# EAGLE design Extended_Proto_Cape_A1 (EAGLE 6.5.0)
AUTHOR: HIEU DUONG; CCO: WWW.CIRCUITCO.COM; DN: 999-0004262; REV: A1; TITLE: EXTENDED PROTO CAPE
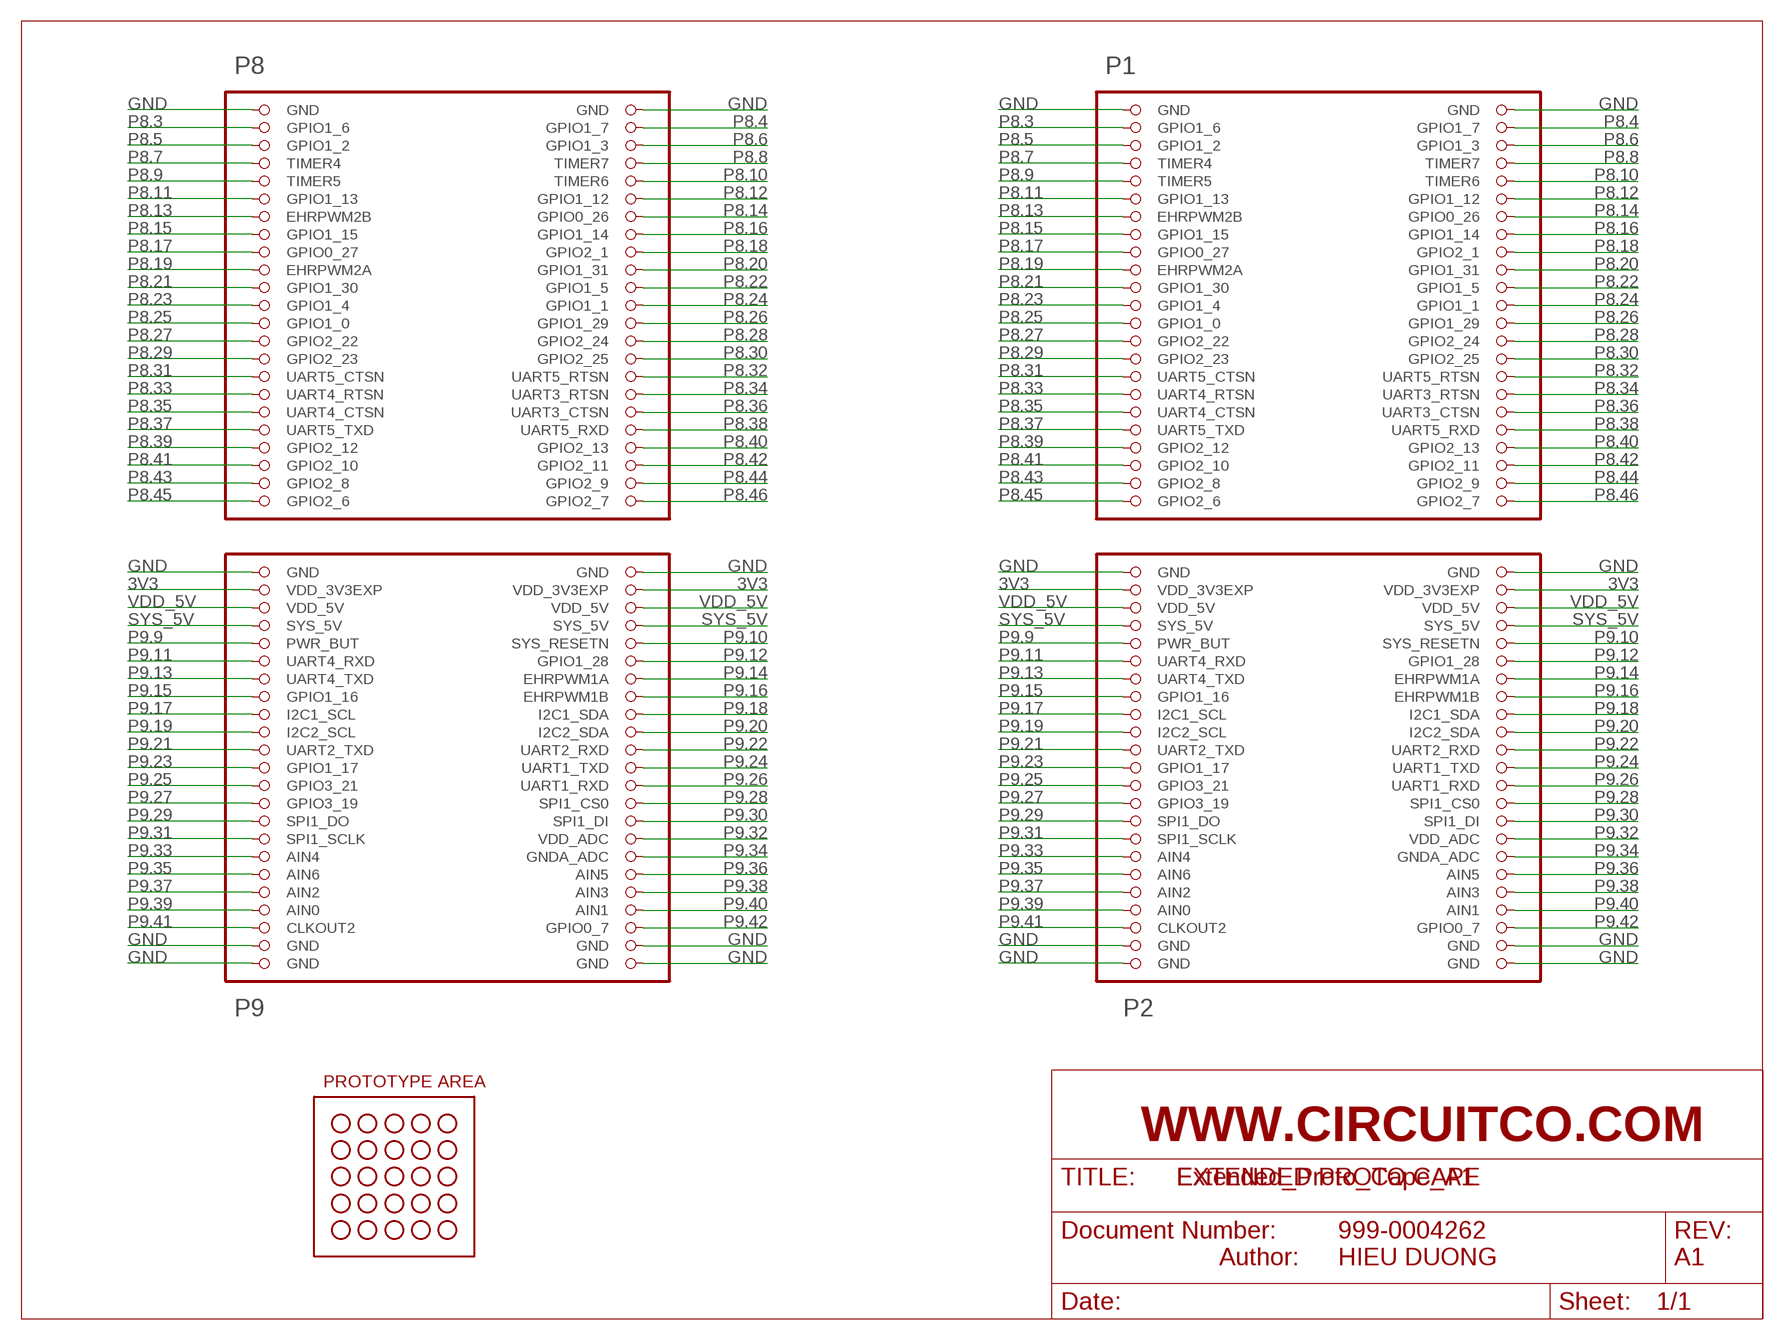
[diagram p0: schematic, sheet 1]

## Parts
U1  BB_OL_EXTPROTO  [BB_OL_EXTPROTO]
U2  PROTO_CAPE_EXT  [PROTO_CAPE_EXT]
U$2  PROTOTYPE_AREA_EXT  [PROTOTYPE_AREA_EXT]

## Nets
3V3: U1.49(VDD_3V3EXP) U1.50(VDD_3V3EXP) U2.49(VDD_3V3EXP) U2.50(VDD_3V3EXP)
GND: U1.1(GND) U1.2(GND) U1.47(GND) U1.48(GND) U1.89(GND) U1.90(GND) U1.91(GND) U1.92(GND) U2.1(GND) U2.2(GND) U2.47(GND) U2.48(GND) U2.89(GND) U2.90(GND) U2.91(GND) U2.92(GND)
P8.3: U1.3(GPIO1_6) U2.3(GPIO1_6)
P8.4: U1.4(GPIO1_7) U2.4(GPIO1_7)
P8.5: U1.5(GPIO1_2) U2.5(GPIO1_2)
P8.6: U1.6(GPIO1_3) U2.6(GPIO1_3)
P8.7: U1.7(TIMER4) U2.7(TIMER4)
P8.8: U1.8(TIMER7) U2.8(TIMER7)
P8.9: U1.9(TIMER5) U2.9(TIMER5)
P8.10: U1.10(TIMER6) U2.10(TIMER6)
P8.11: U1.11(GPIO1_13) U2.11(GPIO1_13)
P8.12: U1.12(GPIO1_12) U2.12(GPIO1_12)
P8.13: U1.13(EHRPWM2B) U2.13(EHRPWM2B)
P8.14: U1.14(GPIO0_26) U2.14(GPIO0_26)
P8.15: U1.15(GPIO1_15) U2.15(GPIO1_15)
P8.16: U1.16(GPIO1_14) U2.16(GPIO1_14)
P8.17: U1.17(GPIO0_27) U2.17(GPIO0_27)
P8.18: U1.18(GPIO2_1) U2.18(GPIO2_1)
P8.19: U1.19(EHRPWM2A) U2.19(EHRPWM2A)
P8.20: U1.20(GPIO1_31) U2.20(GPIO1_31)
P8.21: U1.21(GPIO1_30) U2.21(GPIO1_30)
P8.22: U1.22(GPIO1_5) U2.22(GPIO1_5)
P8.23: U1.23(GPIO1_4) U2.23(GPIO1_4)
P8.24: U1.24(GPIO1_1) U2.24(GPIO1_1)
P8.25: U1.25(GPIO1_0) U2.25(GPIO1_0)
P8.26: U1.26(GPIO1_29) U2.26(GPIO1_29)
P8.27: U1.27(GPIO2_22) U2.27(GPIO2_22)
P8.28: U1.28(GPIO2_24) U2.28(GPIO2_24)
P8.29: U1.29(GPIO2_23) U2.29(GPIO2_23)
P8.30: U1.30(GPIO2_25) U2.30(GPIO2_25)
P8.31: U1.31(UART5_CTSN) U2.31(UART5_CTSN)
P8.32: U1.32(UART5_RTSN) U2.32(UART5_RTSN)
P8.33: U1.33(UART4_RTSN) U2.33(UART4_RTSN)
P8.34: U1.34(UART3_RTSN) U2.34(UART3_RTSN)
P8.35: U1.35(UART4_CTSN) U2.35(UART4_CTSN)
P8.36: U1.36(UART3_CTSN) U2.36(UART3_CTSN)
P8.37: U1.37(UART5_TXD) U2.37(UART5_TXD)
P8.38: U1.38(UART5_RXD) U2.38(UART5_RXD)
P8.39: U1.39(GPIO2_12) U2.39(GPIO2_12)
P8.40: U1.40(GPIO2_13) U2.40(GPIO2_13)
P8.41: U1.41(GPIO2_10) U2.41(GPIO2_10)
P8.42: U1.42(GPIO2_11) U2.42(GPIO2_11)
P8.43: U1.43(GPIO2_8) U2.43(GPIO2_8)
P8.44: U1.44(GPIO2_9) U2.44(GPIO2_9)
P8.45: U1.45(GPIO2_6) U2.45(GPIO2_6)
P8.46: U1.46(GPIO2_7) U2.46(GPIO2_7)
P9.9: U1.55(PWR_BUT) U2.55(PWR_BUT)
P9.10: U1.56(SYS_RESETN) U2.56(SYS_RESETN)
P9.11: U1.57(UART4_RXD) U2.57(UART4_RXD)
P9.12: U1.58(GPIO1_28) U2.58(GPIO1_28)
P9.13: U1.59(UART4_TXD) U2.59(UART4_TXD)
P9.14: U1.60(EHRPWM1A) U2.60(EHRPWM1A)
P9.15: U1.61(GPIO1_16) U2.61(GPIO1_16)
P9.16: U1.62(EHRPWM1B) U2.62(EHRPWM1B)
P9.17: U1.63(I2C1_SCL) U2.63(I2C1_SCL)
P9.18: U1.64(I2C1_SDA) U2.64(I2C1_SDA)
P9.19: U1.65(I2C2_SCL) U2.65(I2C2_SCL)
P9.20: U1.66(I2C2_SDA) U2.66(I2C2_SDA)
P9.21: U1.67(UART2_TXD) U2.67(UART2_TXD)
P9.22: U1.68(UART2_RXD) U2.68(UART2_RXD)
P9.23: U1.69(GPIO1_17) U2.69(GPIO1_17)
P9.24: U1.70(UART1_TXD) U2.70(UART1_TXD)
P9.25: U1.71(GPIO3_21) U2.71(GPIO3_21)
P9.26: U1.72(UART1_RXD) U2.72(UART1_RXD)
P9.27: U1.73(GPIO3_19) U2.73(GPIO3_19)
P9.28: U1.74(SPI1_CS0) U2.74(SPI1_CS0)
P9.29: U1.75(SPI1_DO) U2.75(SPI1_DO)
P9.30: U1.76(SPI1_DI) U2.76(SPI1_DI)
P9.31: U1.77(SPI1_SCLK) U2.77(SPI1_SCLK)
P9.32: U1.78(VDD_ADC) U2.78(VDD_ADC)
P9.33: U1.79(AIN4) U2.79(AIN4)
P9.34: U1.80(GNDA_ADC) U2.80(GNDA_ADC)
P9.35: U1.81(AIN6) U2.81(AIN6)
P9.36: U1.82(AIN5) U2.82(AIN5)
P9.37: U1.83(AIN2) U2.83(AIN2)
P9.38: U1.84(AIN3) U2.84(AIN3)
P9.39: U1.85(AIN0) U2.85(AIN0)
P9.40: U1.86(AIN1) U2.86(AIN1)
P9.41: U1.87(CLKOUT2) U2.87(CLKOUT2)
P9.42: U1.88(GPIO0_7) U2.88(GPIO0_7)
SYS_5V: U1.53(SYS_5V) U1.54(SYS_5V) U2.53(SYS_5V) U2.54(SYS_5V)
VDD_5V: U1.51(VDD_5V) U1.52(VDD_5V) U2.51(VDD_5V) U2.52(VDD_5V)

## Notes on the sheet
- P8 | P1
- P9 | P2
- PROTOTYPE AREA
- Author:

## Library data of the parts
U1 = circuitco-eagle:BB_OL_EXTPROTO: Should match A3 pinout - but not completely tested
U2 = circuitco-eagle:PROTO_CAPE_EXT
U$2 = circuitco-eagle:PROTOTYPE_AREA_EXT

## Board
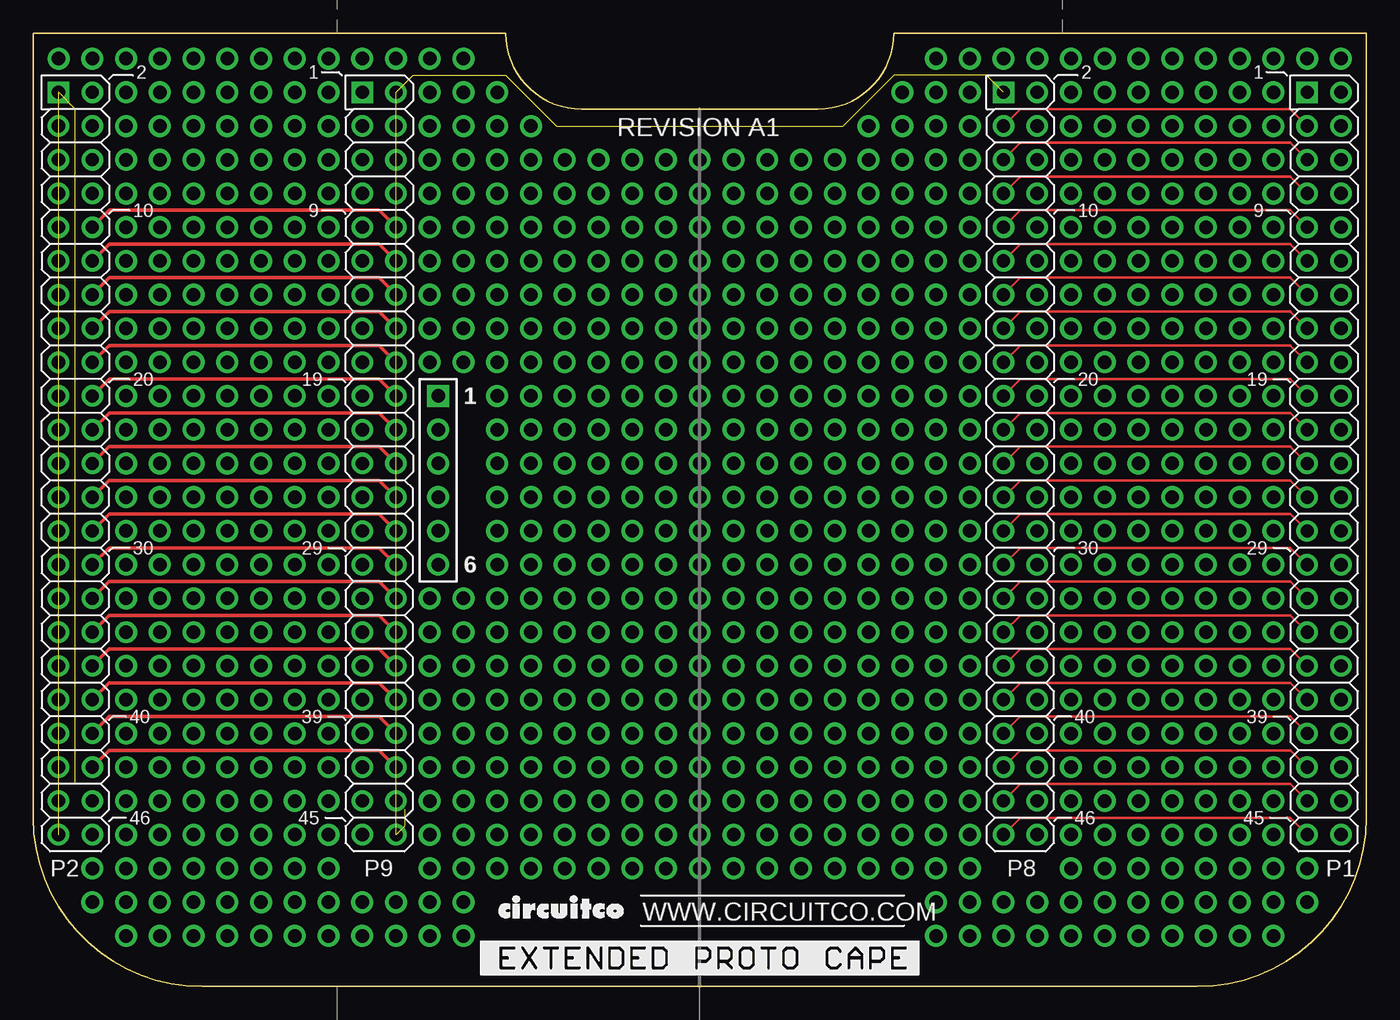
[diagram p1: board, top side]
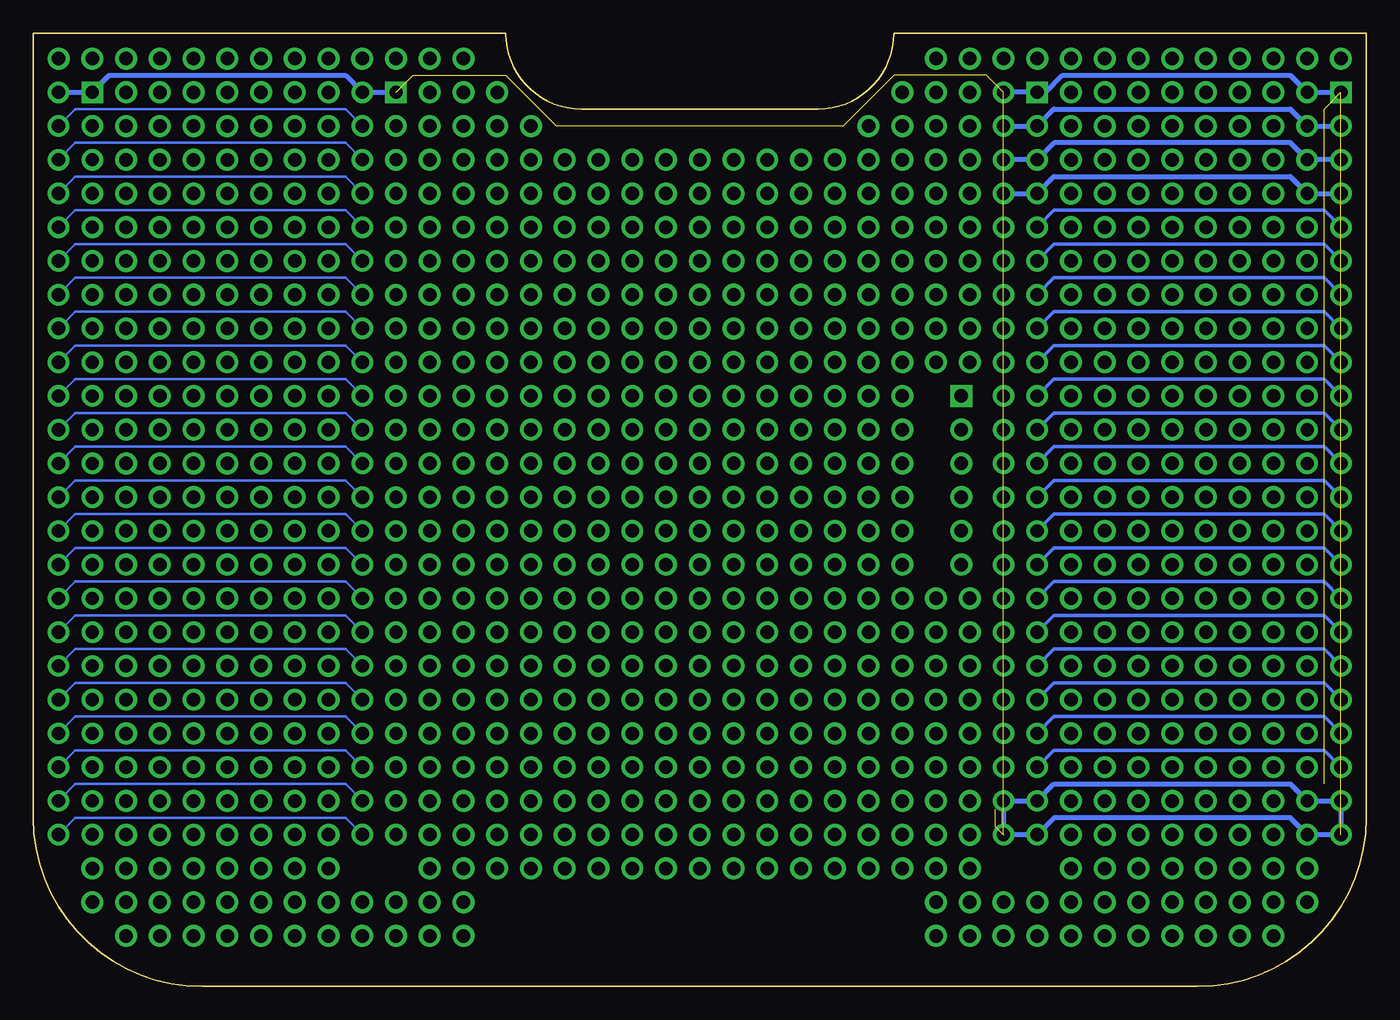
[diagram p2: board, bottom side, seen from below]

Size 100.33 x 71.75 mm. Coordinates in mm from the lower left corner, seen from the top.
Copper layers (1*16): Top 0.035mm / dielectric 1.5mm / Bottom 0.035mm
Design rules "CircuitCo-HD": minimum track width 8mil, minimum drill 15mil, track to track 8mil, track to pad 8mil, pad to pad 3mil, via to via 8mil, smd to smd 0mil, copper to edge 12mil, drill to drill 8mil, minimum pad ring 12mil, minimum via ring 10mil, stop-mask expansion 4mil, vias tented up to drill 25mil, thermal gap 10mil

### Footprints (pad centres in the part's own frame; a part is rotated, then mirrored left to right if it is on the bottom)
BB_OL_EXTPROTO = drill 1 square: 1 50.165,67.31; 47 1.905,67.31 | drill 1: 2 52.705,67.31; 3 50.165,64.77; 4 52.705,64.77; 5 50.165,62.23; 6 52.705,62.23; 7 50.165,59.69; 8 52.705,59.69; 9 50.165,57.15; 10 52.705,57.15; 11 50.165,54.61; 12 52.705,54.61; 13 50.165,52.07; 14 52.705,52.07; 15 50.165,49.53; 16 52.705,49.53; 17 50.165,46.99; 18 52.705,46.99; 19 50.165,44.45; 20 52.705,44.45; 21 50.165,41.91; 22 52.705,41.91; 23 50.165,39.37; 24 52.705,39.37; 25 50.165,36.83; 26 52.705,36.83; 27 50.165,34.29; 28 52.705,34.29; 29 50.165,31.75; 30 52.705,31.75; 31 50.165,29.21; 32 52.705,29.21; 33 50.165,26.67; 34 52.705,26.67; 35 50.165,24.13; 36 52.705,24.13; 37 50.165,21.59; 38 52.705,21.59; 39 50.165,19.05; 40 52.705,19.05; 41 50.165,16.51; 42 52.705,16.51; 43 50.165,13.97; 44 52.705,13.97; 45 50.165,11.43; 46 52.705,11.43; 48 4.445,67.31; 49 1.905,64.77; 50 4.445,64.77; 51 1.905,62.23; 52 4.445,62.23; 53 1.905,59.69; 54 4.445,59.69; 55 1.905,57.15; 56 4.445,57.15; 57 1.905,54.61; 58 4.445,54.61; 59 1.905,52.07; 60 4.445,52.07; 61 1.905,49.53; 62 4.445,49.53; 63 1.905,46.99; 64 4.445,46.99; 65 1.905,44.45; 66 4.445,44.45; 67 1.905,41.91; 68 4.445,41.91; 69 1.905,39.37; 70 4.445,39.37; 71 1.905,36.83; 72 4.445,36.83; 73 1.905,34.29; 74 4.445,34.29; 75 1.905,31.75; 76 4.445,31.75; 77 1.905,29.21; 78 4.445,29.21; 79 1.905,26.67; 80 4.445,26.67; 81 1.905,24.13; 82 4.445,24.13; 83 1.905,21.59; 84 4.445,21.59; 85 1.905,19.05; 86 4.445,19.05; 87 1.905,16.51; 88 4.445,16.51; 89 1.905,13.97; 90 4.445,13.97; 91 1.905,11.43; 92 4.445,11.43
PROTO_CAPE_EXT = drill 1 square: 1 73.025,67.31; 47 -20.955,67.31 | drill 1: 2 75.565,67.31; 3 73.025,64.77; 4 75.565,64.77; 5 73.025,62.23; 6 75.565,62.23; 7 73.025,59.69; 8 75.565,59.69; 9 73.025,57.15; 10 75.565,57.15; 11 73.025,54.61; 12 75.565,54.61; 13 73.025,52.07; 14 75.565,52.07; 15 73.025,49.53; 16 75.565,49.53; 17 73.025,46.99; 18 75.565,46.99; 19 73.025,44.45; 20 75.565,44.45; 21 73.025,41.91; 22 75.565,41.91; 23 73.025,39.37; 24 75.565,39.37; 25 73.025,36.83; 26 75.565,36.83; 27 73.025,34.29; 28 75.565,34.29; 29 73.025,31.75; 30 75.565,31.75; 31 73.025,29.21; 32 75.565,29.21; 33 73.025,26.67; 34 75.565,26.67; 35 73.025,24.13; 36 75.565,24.13; 37 73.025,21.59; 38 75.565,21.59; 39 73.025,19.05; 40 75.565,19.05; 41 73.025,16.51; 42 75.565,16.51; 43 73.025,13.97; 44 75.565,13.97; 45 73.025,11.43; 46 75.565,11.43; 48 -18.415,67.31; 49 -20.955,64.77; 50 -18.415,64.77; 51 -20.955,62.23; 52 -18.415,62.23; 53 -20.955,59.69; 54 -18.415,59.69; 55 -20.955,57.15; 56 -18.415,57.15; 57 -20.955,54.61; 58 -18.415,54.61; 59 -20.955,52.07; 60 -18.415,52.07; 61 -20.955,49.53; 62 -18.415,49.53; 63 -20.955,46.99; 64 -18.415,46.99; 65 -20.955,44.45; 66 -18.415,44.45; 67 -20.955,41.91; 68 -18.415,41.91; 69 -20.955,39.37; 70 -18.415,39.37; 71 -20.955,36.83; 72 -18.415,36.83; 73 -20.955,34.29; 74 -18.415,34.29; 75 -20.955,31.75; 76 -18.415,31.75; 77 -20.955,29.21; 78 -18.415,29.21; 79 -20.955,26.67; 80 -18.415,26.67; 81 -20.955,24.13; 82 -18.415,24.13; 83 -20.955,21.59; 84 -18.415,21.59; 85 -20.955,19.05; 86 -18.415,19.05; 87 -20.955,16.51; 88 -18.415,16.51; 89 -20.955,13.97; 90 -18.415,13.97; 91 -20.955,11.43; 92 -18.415,11.43
PROTOTYPE_AREA_EXT = drill 1.016 pad 1.651 square: P$1 30.48,44.45 | drill 1.016 pad 1.651: P$2 30.48,41.91; P$3 30.48,39.37; P$4 30.48,36.83; P$5 30.48,34.29; P$6 30.48,31.75; P$7 29.845,67.31; P$8 29.845,64.77; P$9 29.845,62.23; P$10 29.845,59.69; P$11 29.845,57.15; P$12 29.845,54.61; P$13 29.845,52.07; P$14 29.845,49.53; P$15 29.845,46.99; P$16 32.385,67.31; P$17 32.385,64.77; P$18 32.385,62.23; P$19 32.385,59.69; P$20 32.385,57.15; P$21 32.385,54.61; P$22 32.385,52.07; P$23 32.385,49.53; P$24 32.385,46.99; P$25 34.925,67.31; P$26 34.925,64.77; P$27 34.925,62.23; P$28 34.925,59.69; P$29 34.925,57.15; P$30 34.925,54.61; P$31 34.925,52.07; P$32 34.925,49.53; P$33 34.925,46.99; P$34 29.845,69.85; P$35 32.385,69.85; P$36 27.305,69.85; P$37 24.765,69.85; P$38 34.925,44.45; P$39 34.925,41.91; P$40 34.925,39.37; P$41 34.925,36.83; P$42 34.925,34.29; P$43 34.925,31.75; P$44 34.925,29.21; P$45 34.925,26.67; P$46 34.925,24.13; P$47 34.925,21.59; P$48 34.925,19.05; P$49 34.925,16.51; P$50 34.925,13.97; P$51 34.925,11.43; P$52 34.925,8.89; P$53 24.765,6.35; P$54 24.765,3.81; P$55 32.385,29.21; P$56 32.385,26.67; P$57 32.385,24.13; P$58 32.385,21.59; P$59 32.385,19.05; P$60 32.385,16.51; P$61 32.385,13.97; P$62 32.385,11.43; P$63 32.385,8.89; P$64 27.305,6.35; P$65 27.305,3.81; P$66 29.845,29.21; P$67 29.845,26.67; P$68 29.845,24.13; P$69 29.845,21.59; P$70 29.845,19.05; P$71 29.845,16.51; P$72 29.845,13.97; P$73 29.845,11.43; P$74 29.845,8.89; P$75 29.845,6.35; P$76 29.845,3.81; P$77 32.385,6.35; P$78 70.485,6.35; P$79 70.485,3.81; P$80 32.385,3.81; P$81 73.025,6.35; P$82 73.025,3.81; P$83 37.465,64.77; P$84 37.465,62.23; P$85 37.465,59.69; P$86 37.465,57.15; P$87 37.465,54.61; P$88 37.465,52.07; P$89 37.465,49.53; P$90 37.465,46.99; P$91 37.465,44.45; P$92 37.465,41.91; P$93 37.465,39.37; P$94 37.465,36.83; P$95 37.465,34.29; P$96 37.465,31.75; P$97 37.465,29.21; P$98 37.465,26.67; P$99 37.465,24.13; P$100 37.465,21.59; P$101 37.465,19.05; P$102 37.465,16.51; P$103 37.465,13.97; P$104 37.465,11.43; P$105 37.465,8.89; P$106 75.565,6.35; P$107 75.565,3.81; P$108 40.005,62.23; P$109 40.005,59.69; P$110 40.005,57.15; P$111 40.005,54.61; P$112 40.005,52.07; P$113 40.005,49.53; P$114 40.005,46.99; P$115 40.005,44.45; P$116 40.005,41.91; P$117 40.005,39.37; P$118 40.005,36.83; P$119 40.005,34.29; P$120 40.005,31.75; P$121 40.005,29.21; P$122 40.005,26.67; P$123 40.005,24.13; P$124 40.005,21.59; P$125 40.005,19.05; P$126 40.005,16.51; P$127 40.005,13.97; P$128 40.005,11.43; P$129 40.005,8.89; P$130 67.945,6.35; P$131 67.945,3.81; P$132 42.545,62.23; P$133 42.545,59.69; P$134 42.545,57.15; P$135 42.545,54.61; P$136 42.545,52.07; P$137 42.545,49.53; P$138 42.545,46.99; P$139 42.545,44.45; P$140 42.545,41.91; P$141 42.545,39.37; P$142 42.545,36.83; P$143 42.545,34.29; P$144 42.545,31.75; P$145 42.545,29.21; P$146 42.545,26.67; P$147 42.545,24.13; P$148 42.545,21.59; P$149 42.545,19.05; P$150 42.545,16.51; P$151 42.545,13.97; P$152 42.545,11.43; P$153 42.545,8.89; P$156 45.085,62.23; P$157 45.085,59.69; P$158 45.085,57.15; P$159 45.085,54.61; P$160 45.085,52.07; P$161 45.085,49.53; P$162 45.085,46.99; P$163 45.085,44.45; P$164 45.085,41.91; P$165 45.085,39.37; P$166 45.085,36.83; P$167 45.085,34.29; P$168 45.085,31.75; P$169 47.625,49.53; P$170 47.625,46.99; P$171 45.085,24.13; P$172 45.085,21.59; P$173 45.085,19.05; P$174 45.085,16.51; P$175 45.085,13.97; P$176 45.085,11.43; P$177 45.085,8.89; P$180 47.625,62.23; P$181 47.625,59.69; P$182 47.625,57.15; P$183 47.625,54.61; P$184 47.625,52.07; P$185 47.625,44.45; P$186 47.625,41.91; P$187 47.625,39.37; P$188 47.625,36.83; P$189 47.625,34.29; P$190 47.625,31.75; P$191 50.165,49.53; P$192 50.165,46.99; P$193 50.165,44.45; P$194 50.165,41.91; P$195 47.625,24.13; P$196 47.625,21.59; P$197 47.625,19.05; P$198 47.625,16.51; P$199 47.625,13.97; P$200 47.625,11.43; P$201 47.625,8.89; P$204 50.165,62.23; P$205 50.165,59.69; P$206 50.165,57.15; P$207 50.165,54.61; P$208 50.165,52.07; P$209 50.165,39.37; P$210 50.165,36.83; P$211 50.165,34.29; P$212 50.165,31.75; P$213 52.705,49.53; P$214 52.705,46.99; P$215 52.705,44.45; P$216 52.705,41.91; P$217 52.705,39.37; P$218 52.705,36.83; P$219 50.165,24.13; P$220 50.165,21.59; P$221 50.165,19.05; P$222 50.165,16.51; P$223 50.165,13.97; P$224 50.165,11.43; P$225 50.165,8.89; P$228 52.705,62.23; P$229 52.705,59.69; P$230 52.705,57.15; P$231 52.705,54.61; P$232 52.705,52.07; P$233 52.705,34.29; P$234 52.705,31.75; P$235 55.245,49.53; P$236 55.245,46.99; P$237 55.245,44.45; P$238 55.245,41.91; P$239 55.245,39.37; P$240 55.245,36.83; P$241 55.245,34.29; P$242 55.245,31.75; P$243 52.705,24.13; P$244 52.705,21.59; P$245 52.705,19.05; P$246 52.705,16.51; P$247 52.705,13.97; P$248 52.705,11.43; P$249 52.705,8.89; P$252 55.245,62.23; P$253 55.245,59.69; P$254 55.245,57.15; P$255 55.245,54.61; P$256 55.245,52.07; P$257 55.245,29.21; P$258 55.245,26.67; P$259 45.085,29.21; P$260 45.085,26.67; P$261 47.625,29.21; P$262 47.625,26.67; P$263 50.165,29.21; P$264 50.165,26.67; P$265 52.705,29.21; P$266 52.705,26.67; P$267 55.245,24.13; P$268 55.245,21.59; P$269 55.245,19.05; P$270 55.245,16.51; P$271 55.245,13.97; P$272 55.245,11.43; P$273 55.245,8.89; P$276 57.785,62.23; P$277 57.785,59.69; P$278 57.785,57.15; P$279 57.785,54.61; P$280 57.785,52.07; P$281 57.785,49.53; P$282 57.785,46.99; P$283 57.785,44.45; P$284 57.785,41.91; P$285 57.785,39.37; P$286 57.785,36.83; P$287 57.785,34.29; P$288 57.785,31.75; P$289 57.785,29.21; P$290 57.785,26.67; P$291 57.785,24.13; P$292 57.785,21.59; P$293 57.785,19.05; P$294 57.785,16.51; P$295 57.785,13.97; P$296 57.785,11.43; P$297 57.785,8.89; P$300 60.325,62.23; P$301 60.325,59.69; P$302 60.325,57.15; P$303 60.325,54.61; P$304 60.325,52.07; P$305 60.325,49.53; P$306 60.325,46.99; P$307 60.325,44.45; P$308 60.325,41.91; P$309 60.325,39.37; P$310 60.325,36.83; P$311 60.325,34.29; P$312 60.325,31.75; P$313 60.325,29.21; P$314 60.325,26.67; P$315 60.325,24.13; P$316 60.325,21.59; P$317 60.325,19.05; P$318 60.325,16.51; P$319 60.325,13.97; P$320 60.325,11.43; P$321 60.325,8.89; P$324 62.865,62.23; P$325 62.865,59.69; P$326 62.865,57.15; P$327 62.865,54.61; P$328 62.865,52.07; P$329 62.865,49.53; P$330 62.865,46.99; P$331 62.865,44.45; P$332 62.865,41.91; P$333 62.865,39.37; P$334 62.865,36.83; P$335 62.865,34.29; P$336 62.865,31.75; P$337 62.865,29.21; P$338 62.865,26.67; P$339 62.865,24.13; P$340 62.865,21.59; P$341 62.865,19.05; P$342 62.865,16.51; P$343 62.865,13.97; P$344 62.865,11.43; P$345 62.865,8.89; P$348 65.405,62.23; P$349 65.405,59.69; P$350 65.405,57.15; P$351 65.405,54.61; P$352 65.405,52.07; P$353 65.405,49.53; P$354 65.405,46.99; P$355 65.405,44.45; P$356 65.405,41.91; P$357 65.405,39.37; P$358 65.405,36.83; P$359 65.405,34.29; P$360 65.405,31.75; P$361 65.405,29.21; P$362 65.405,26.67; P$363 65.405,24.13; P$364 65.405,21.59; P$365 65.405,19.05; P$366 65.405,16.51; P$367 65.405,13.97; P$368 65.405,11.43; P$369 65.405,8.89; P$372 67.945,62.23; P$373 67.945,59.69; P$374 67.945,57.15; P$375 67.945,54.61; P$376 67.945,52.07; P$377 67.945,49.53; P$378 67.945,46.99; P$379 67.945,44.45; P$380 67.945,41.91; P$381 67.945,39.37; P$382 67.945,36.83; P$383 67.945,34.29; P$384 67.945,31.75; P$385 67.945,29.21; P$386 67.945,26.67; P$387 67.945,24.13; P$388 67.945,21.59; P$389 67.945,19.05; P$390 67.945,16.51; P$391 67.945,13.97; P$392 67.945,11.43; P$393 67.945,8.89; P$396 70.485,62.23; P$397 70.485,59.69; P$398 70.485,57.15; P$399 70.485,54.61; P$400 70.485,52.07; P$401 70.485,49.53; P$402 70.485,46.99; P$403 70.485,44.45; P$404 70.485,41.91; P$405 70.485,39.37; P$406 70.485,36.83; P$407 70.485,34.29; P$408 70.485,31.75; P$409 70.485,29.21; P$410 70.485,26.67; P$411 70.485,24.13; P$412 70.485,21.59; P$413 70.485,19.05; P$414 70.485,16.51; P$415 70.485,13.97; P$416 70.485,11.43; P$417 70.485,8.89; P$420 62.865,64.77; P$421 65.405,64.77; P$422 67.945,64.77; P$423 70.485,64.77; P$424 65.405,67.31; P$425 67.945,67.31; P$426 70.485,67.31; P$427 67.945,69.85; P$428 70.485,69.85; P$429 78.105,62.23; P$430 78.105,59.69; P$431 78.105,57.15; P$432 78.105,54.61; P$433 78.105,52.07; P$434 78.105,49.53; P$435 78.105,46.99; P$436 78.105,44.45; P$437 78.105,41.91; P$438 78.105,39.37; P$439 78.105,36.83; P$440 78.105,34.29; P$441 78.105,31.75; P$442 78.105,29.21; P$443 78.105,26.67; P$444 78.105,24.13; P$445 78.105,21.59; P$446 78.105,19.05; P$447 78.105,16.51; P$448 78.105,13.97; P$449 78.105,11.43; P$450 78.105,8.89; P$451 78.105,6.35; P$452 78.105,3.81; P$453 80.645,62.23; P$454 80.645,59.69; P$455 80.645,57.15; P$456 80.645,54.61; P$457 80.645,52.07; P$458 80.645,49.53; P$459 80.645,46.99; P$460 80.645,44.45; P$461 80.645,41.91; P$462 80.645,39.37; P$463 80.645,36.83; P$464 80.645,34.29; P$465 80.645,31.75; P$466 80.645,29.21; P$467 80.645,26.67; P$468 80.645,24.13; P$469 80.645,21.59; P$470 80.645,19.05; P$471 80.645,16.51; P$472 80.645,13.97; P$473 80.645,11.43; P$474 80.645,8.89; P$475 80.645,6.35; P$476 80.645,3.81; P$477 78.105,64.77; P$478 80.645,64.77; P$479 78.105,67.31; P$480 80.645,67.31; P$487 73.025,69.85; P$488 75.565,69.85; P$489 78.105,69.85; P$490 80.645,69.85; P$491 83.185,62.23; P$492 83.185,59.69; P$493 83.185,57.15; P$494 83.185,54.61; P$495 83.185,52.07; P$496 83.185,49.53; P$497 83.185,46.99; P$498 83.185,44.45; P$499 83.185,41.91; P$500 83.185,39.37; P$501 83.185,36.83; P$502 83.185,34.29; P$503 83.185,31.75; P$504 83.185,29.21; P$505 83.185,26.67; P$506 83.185,24.13; P$507 83.185,21.59; P$508 83.185,19.05; P$509 83.185,16.51; P$510 83.185,13.97; P$511 83.185,11.43; P$512 83.185,8.89; P$513 83.185,6.35; P$514 83.185,3.81; P$515 85.725,62.23; P$516 85.725,59.69; P$517 85.725,57.15; P$518 85.725,54.61; P$519 85.725,52.07; P$520 85.725,49.53; P$521 85.725,46.99; P$522 85.725,44.45; P$523 85.725,41.91; P$524 85.725,39.37; P$525 85.725,36.83; P$526 85.725,34.29; P$527 85.725,31.75; P$528 85.725,29.21; P$529 85.725,26.67; P$530 85.725,24.13; P$531 85.725,21.59; P$532 85.725,19.05; P$533 85.725,16.51; P$534 85.725,13.97; P$535 85.725,11.43; P$536 85.725,8.89; P$537 85.725,6.35; P$538 85.725,3.81; P$539 83.185,64.77; P$540 85.725,64.77; P$541 83.185,67.31; P$542 85.725,67.31; P$543 83.185,69.85; P$544 85.725,69.85; P$545 88.265,62.23; P$546 88.265,59.69; P$547 88.265,57.15; P$548 88.265,54.61; P$549 88.265,52.07; P$550 88.265,49.53; P$551 88.265,46.99; P$552 88.265,44.45; P$553 88.265,41.91; P$554 88.265,39.37; P$555 88.265,36.83; P$556 88.265,34.29; P$557 88.265,31.75; P$558 88.265,29.21; P$559 88.265,26.67; P$560 88.265,24.13; P$561 88.265,21.59; P$562 88.265,19.05; P$563 88.265,16.51; P$564 88.265,13.97; P$565 88.265,11.43; P$566 88.265,8.89; P$567 88.265,6.35; P$568 88.265,3.81; P$569 88.265,64.77; P$570 88.265,67.31; P$571 88.265,69.85; P$572 90.805,62.23; P$573 90.805,59.69; P$574 90.805,57.15; P$575 90.805,54.61; P$576 90.805,52.07; P$577 90.805,49.53; P$578 90.805,46.99; P$579 90.805,44.45; P$580 90.805,41.91; P$581 90.805,39.37; P$582 90.805,36.83; P$583 90.805,34.29; P$584 90.805,31.75; P$585 90.805,29.21; P$586 90.805,26.67; P$587 90.805,24.13; P$588 90.805,21.59; P$589 90.805,19.05; P$590 90.805,16.51; P$591 90.805,13.97; P$592 90.805,11.43; P$593 90.805,8.89; P$594 90.805,6.35; P$595 90.805,3.81; P$596 90.805,64.77; P$597 90.805,67.31; P$598 90.805,69.85; P$599 93.345,62.23; P$600 93.345,59.69; P$601 93.345,57.15; P$602 93.345,54.61; P$603 93.345,52.07; P$604 93.345,49.53; P$605 93.345,46.99; P$606 93.345,44.45; P$607 93.345,41.91; P$608 93.345,39.37; P$609 93.345,36.83; P$610 93.345,34.29; P$611 93.345,31.75; P$612 93.345,29.21; P$613 93.345,26.67; P$614 93.345,24.13; P$615 93.345,21.59; P$616 93.345,19.05; P$617 93.345,16.51; P$618 93.345,13.97; P$619 93.345,11.43; P$620 93.345,8.89; P$621 93.345,6.35; P$622 93.345,3.81; P$623 93.345,64.77; P$624 93.345,67.31; P$625 93.345,69.85; P$626 6.985,62.23; P$627 6.985,59.69; P$628 6.985,57.15; P$629 6.985,54.61; P$630 6.985,52.07; P$631 6.985,49.53; P$632 6.985,46.99; P$633 6.985,44.45; P$634 6.985,41.91; P$635 6.985,39.37; P$636 6.985,36.83; P$637 6.985,34.29; P$638 6.985,31.75; P$639 6.985,29.21; P$640 6.985,26.67; P$641 6.985,24.13; P$642 6.985,21.59; P$643 6.985,19.05; P$644 6.985,16.51; P$645 6.985,13.97; P$646 6.985,11.43; P$647 6.985,8.89; P$648 6.985,6.35; P$649 6.985,3.81; P$650 9.525,62.23; P$651 9.525,59.69; P$652 9.525,57.15; P$653 9.525,54.61; P$654 9.525,52.07; P$655 9.525,49.53; P$656 9.525,46.99; P$657 9.525,44.45; P$658 9.525,41.91; P$659 9.525,39.37; P$660 9.525,36.83; P$661 9.525,34.29; P$662 9.525,31.75; P$663 9.525,29.21; P$664 9.525,26.67; P$665 9.525,24.13; P$666 9.525,21.59; P$667 9.525,19.05; P$668 9.525,16.51; P$669 9.525,13.97; P$670 9.525,11.43; P$671 9.525,8.89; P$672 9.525,6.35; P$673 9.525,3.81; P$674 6.985,64.77; P$675 9.525,64.77; P$676 6.985,67.31; P$677 9.525,67.31; P$678 6.985,69.85; P$679 9.525,69.85; P$680 12.065,62.23; P$681 12.065,59.69; P$682 12.065,57.15; P$683 12.065,54.61; P$684 12.065,52.07; P$685 12.065,49.53; P$686 12.065,46.99; P$687 12.065,44.45; P$688 12.065,41.91; P$689 12.065,39.37; P$690 12.065,36.83; P$691 12.065,34.29; P$692 12.065,31.75; P$693 12.065,29.21; P$694 12.065,26.67; P$695 12.065,24.13; P$696 12.065,21.59; P$697 12.065,19.05; P$698 12.065,16.51; P$699 12.065,13.97; P$700 12.065,11.43; P$701 12.065,8.89; P$702 12.065,6.35; P$703 12.065,3.81; P$704 14.605,62.23; P$705 14.605,59.69; P$706 14.605,57.15; P$707 14.605,54.61; P$708 14.605,52.07; P$709 14.605,49.53; P$710 14.605,46.99; P$711 14.605,44.45; P$712 14.605,41.91; P$713 14.605,39.37; P$714 14.605,36.83; P$715 14.605,34.29; P$716 14.605,31.75; P$717 14.605,29.21; P$718 14.605,26.67; P$719 14.605,24.13; P$720 14.605,21.59; P$721 14.605,19.05; P$722 14.605,16.51; P$723 14.605,13.97; P$724 14.605,11.43; P$725 14.605,8.89; P$726 14.605,6.35; P$727 14.605,3.81; P$728 12.065,64.77; P$729 14.605,64.77; P$730 12.065,67.31; P$731 14.605,67.31; P$732 12.065,69.85; P$733 14.605,69.85; P$734 17.145,62.23; P$735 17.145,59.69; P$736 17.145,57.15; P$737 17.145,54.61; P$738 17.145,52.07; P$739 17.145,49.53; P$740 17.145,46.99; P$741 17.145,44.45; P$742 17.145,41.91; P$743 17.145,39.37; P$744 17.145,36.83; P$745 17.145,34.29; P$746 17.145,31.75; P$747 17.145,29.21; P$748 17.145,26.67; P$749 17.145,24.13; P$750 17.145,21.59; P$751 17.145,19.05; P$752 17.145,16.51; P$753 17.145,13.97; P$754 17.145,11.43; P$755 17.145,8.89; P$756 17.145,6.35; P$757 17.145,3.81; P$758 17.145,64.77; P$759 17.145,67.31; P$760 17.145,69.85; P$761 19.685,62.23; P$762 19.685,59.69; P$763 19.685,57.15; P$764 19.685,54.61; P$765 19.685,52.07; P$766 19.685,49.53; P$767 19.685,46.99; P$768 19.685,44.45; P$769 19.685,41.91; P$770 19.685,39.37; P$771 19.685,36.83; P$772 19.685,34.29; P$773 19.685,31.75; P$774 19.685,29.21; P$775 19.685,26.67; P$776 19.685,24.13; P$777 19.685,21.59; P$778 19.685,19.05; P$779 19.685,16.51; P$780 19.685,13.97; P$781 19.685,11.43; P$782 19.685,8.89; P$783 19.685,6.35; P$784 19.685,3.81; P$785 19.685,64.77; P$786 19.685,67.31; P$787 19.685,69.85; P$788 22.225,62.23; P$789 22.225,59.69; P$790 22.225,57.15; P$791 22.225,54.61; P$792 22.225,52.07; P$793 22.225,49.53; P$794 22.225,46.99; P$795 22.225,44.45; P$796 22.225,41.91; P$797 22.225,39.37; P$798 22.225,36.83; P$799 22.225,34.29; P$800 22.225,31.75; P$801 22.225,29.21; P$802 22.225,26.67; P$803 22.225,24.13; P$804 22.225,21.59; P$805 22.225,19.05; P$806 22.225,16.51; P$807 22.225,13.97; P$808 22.225,11.43; P$809 22.225,8.89; P$810 22.225,6.35; P$811 22.225,3.81; P$812 22.225,64.77; P$813 22.225,67.31; P$814 22.225,69.85; P$836 95.885,8.89; P$837 95.885,6.35; P$840 95.885,69.85; P$865 98.425,69.85; P$886 4.445,8.89; P$887 4.445,6.35; P$890 4.445,69.85; P$914 1.905,69.85

### Placement (x,y rotation side)
DRILEGEND  [DRILEGEND]  -1.02,-21.07 0 top  (outside the outline)
U1  22.86,0 0 top
U2  22.86,0 0 top
U$1  [NEGA-EXTPROTOCAPE]  32.39,-0.64 0 top
U$2  0,0 0 top

### Tracks (layer width: path | path; a pad name or v marks a point on that pad's centre or on a via)
3V3
  Bottom 0.381: U1.50 U1.49 23.49,66.04 5.71,66.04 U2.50 U2.49
GND  (13 unrouted)
  Bottom 0.381: U2.2 U2.1 94.61,68.58 76.83,68.58 U1.2 U1.1 | U1.48 U1.47 24.13,67.31 22.86,68.58 5.71,68.58 U2.48 U2.47 | U1.90 U1.89 23.49,15.24 5.71,15.24 U2.90 U2.89 U2.91 U2.92 5.71,12.7 23.49,12.7 U1.91 U1.92 U1.90
P8.3
  Top 0.203: U1.3 74.3,66.04 94.61,66.04 U2.3
P8.4
  Bottom 0.203: U1.4 76.83,66.04 97.16,66.04 U2.4
P8.5
  Top 0.203: U1.5 74.3,63.5 94.61,63.5 U2.5
P8.6
  Bottom 0.203: U1.6 76.83,63.5 97.16,63.5 U2.6
P8.7
  Top 0.203: U1.7 74.3,60.96 94.61,60.96 U2.7
P8.8
  Bottom 0.203: U1.8 76.83,60.96 97.16,60.96 U2.8
P8.9
  Top 0.203: U1.9 74.3,58.42 94.61,58.42 U2.9
P8.10
  Bottom 0.203: U1.10 76.83,58.42 97.16,58.42 U2.10
P8.11
  Top 0.203: U1.11 74.3,55.88 94.61,55.88 U2.11
P8.12
  Bottom 0.203: U1.12 76.83,55.88 97.16,55.88 U2.12
P8.13
  Top 0.203: U1.13 74.3,53.34 94.61,53.34 U2.13
P8.14
  Bottom 0.203: U1.14 76.83,53.34 97.16,53.34 U2.14
P8.15
  Top 0.203: U1.15 74.3,50.8 94.61,50.8 U2.15
P8.16
  Bottom 0.203: U1.16 76.83,50.8 97.16,50.8 U2.16
P8.17
  Top 0.203: U1.17 74.3,48.26 94.61,48.26 U2.17
P8.18
  Bottom 0.203: U1.18 76.83,48.26 97.16,48.26 U2.18
P8.19
  Top 0.203: U1.19 74.3,45.72 94.61,45.72 U2.19
P8.20
  Bottom 0.203: U1.20 76.83,45.72 97.16,45.72 U2.20
P8.21
  Top 0.203: U1.21 74.3,43.18 94.61,43.18 U2.21
P8.22
  Bottom 0.203: U1.22 76.83,43.18 97.16,43.18 U2.22
P8.23
  Top 0.203: U1.23 74.3,40.64 94.61,40.64 U2.23
P8.24
  Bottom 0.203: U1.24 76.83,40.64 97.16,40.64 U2.24
P8.25
  Top 0.203: U1.25 74.3,38.1 94.61,38.1 U2.25
P8.26
  Bottom 0.203: U1.26 76.83,38.1 97.16,38.1 U2.26
P8.27
  Top 0.203: U1.27 74.3,35.56 94.61,35.56 U2.27
P8.28
  Bottom 0.203: U1.28 76.83,35.56 97.16,35.56 U2.28
P8.29
  Top 0.203: U1.29 74.3,33.02 94.61,33.02 U2.29
P8.30
  Bottom 0.203: U1.30 76.83,33.02 97.16,33.02 U2.30
P8.31
  Top 0.203: U1.31 74.3,30.48 94.61,30.48 U2.31
P8.32
  Bottom 0.203: U1.32 76.83,30.48 97.16,30.48 U2.32
P8.33
  Top 0.203: U1.33 74.3,27.94 94.61,27.94 U2.33
P8.34
  Bottom 0.203: U1.34 76.83,27.94 97.16,27.94 U2.34
P8.35
  Top 0.203: U1.35 74.3,25.4 94.61,25.4 U2.35
P8.36
  Bottom 0.203: U1.36 76.83,25.4 97.16,25.4 U2.36
P8.37
  Top 0.203: U1.37 74.3,22.86 94.61,22.86 U2.37
P8.38
  Bottom 0.203: U1.38 76.83,22.86 97.16,22.86 U2.38
P8.39
  Top 0.203: U1.39 74.3,20.32 94.61,20.32 U2.39
P8.40
  Bottom 0.203: U1.40 76.83,20.32 97.16,20.32 U2.40
P8.41
  Top 0.203: U1.41 74.3,17.78 94.61,17.78 U2.41
P8.42
  Bottom 0.203: U1.42 76.83,17.78 97.16,17.78 U2.42
P8.43
  Top 0.203: U1.43 74.3,15.24 94.61,15.24 U2.43
P8.44
  Bottom 0.203: U1.44 76.83,15.24 97.16,15.24 U2.44
P8.45
  Top 0.203: U1.45 74.3,12.7 94.61,12.7 U2.45
P8.46
  Bottom 0.203: U1.46 76.83,12.7 97.16,12.7 U2.46
P9.9
  Bottom 0.254: U1.55 23.49,58.42 3.17,58.42 U2.55
P9.10
  Top 0.254: U1.56 26.04,58.42 5.71,58.42 U2.56
P9.11
  Bottom 0.254: U2.57 3.17,55.88 23.49,55.88 U1.57
P9.12
  Top 0.254: U1.58 26.04,55.88 5.71,55.88 U2.58
P9.13
  Bottom 0.254: U1.59 23.49,53.34 3.17,53.34 U2.59
P9.14
  Top 0.254: U1.60 26.04,53.34 5.71,53.34 U2.60
P9.15
  Bottom 0.254: U2.61 3.17,50.8 23.49,50.8 U1.61
P9.16
  Top 0.254: U1.62 26.04,50.8 5.71,50.8 U2.62
P9.17
  Bottom 0.254: U1.63 23.49,48.26 3.17,48.26 U2.63
P9.18
  Top 0.254: U1.64 26.04,48.26 5.71,48.26 U2.64
P9.19
  Bottom 0.254: U2.65 3.17,45.72 23.49,45.72 U1.65
P9.20
  Top 0.254: U1.66 26.04,45.72 5.71,45.72 U2.66
P9.21
  Bottom 0.254: U1.67 23.49,43.18 3.17,43.18 U2.67
P9.22
  Top 0.254: U1.68 26.04,43.18 5.71,43.18 U2.68
P9.23
  Bottom 0.254: U2.69 3.17,40.64 23.49,40.64 U1.69
P9.24
  Top 0.254: U1.70 26.04,40.64 5.71,40.64 U2.70
P9.25
  Bottom 0.254: U1.71 23.49,38.1 3.17,38.1 U2.71
P9.26
  Top 0.254: U1.72 26.04,38.1 5.71,38.1 U2.72
P9.27
  Bottom 0.254: U2.73 3.17,35.56 23.49,35.56 U1.73
P9.28
  Top 0.254: U1.74 26.04,35.56 5.71,35.56 U2.74
P9.29
  Bottom 0.254: U1.75 23.49,33.02 3.17,33.02 U2.75
P9.30
  Top 0.254: U1.76 26.04,33.02 5.71,33.02 U2.76
P9.31
  Bottom 0.254: U2.77 3.17,30.48 23.49,30.48 U1.77
P9.32
  Top 0.254: U1.78 26.04,30.48 5.71,30.48 U2.78
P9.33
  Bottom 0.254: U1.79 23.49,27.94 3.17,27.94 U2.79
P9.34
  Top 0.254: U1.80 26.04,27.94 5.71,27.94 U2.80
P9.35
  Bottom 0.254: U2.81 3.17,25.4 23.49,25.4 U1.81
P9.36
  Top 0.254: U1.82 26.04,25.4 5.71,25.4 U2.82
P9.37
  Bottom 0.254: U1.83 23.49,22.86 3.17,22.86 U2.83
P9.38
  Top 0.254: U1.84 26.04,22.86 5.71,22.86 U2.84
P9.39
  Bottom 0.254: U2.85 3.17,20.32 23.49,20.32 U1.85
P9.40
  Top 0.254: U1.86 26.04,20.32 5.71,20.32 U2.86
P9.41
  Bottom 0.254: U1.87 23.49,17.78 3.17,17.78 U2.87
P9.42
  Top 0.254: U1.88 26.04,17.78 5.71,17.78 U2.88
SYS_5V
  Bottom 0.381: U1.54 U1.53 23.49,60.96 5.71,60.96 U2.54 U2.53
VDD_5V
  Bottom 0.381: U2.51 U2.52 5.71,63.5 23.49,63.5 U1.51 U1.52

### Text on the board
tPlace: 2 | 1 | 2 | 1 | REVISION A1 | 10 | 9 | 10 | 9 | 20 | 19 | 20 | 19 | 1 | 30 | 29 | 30 | 29 | 6 | 40 | 39 | 40 | 39 | 46 | 45 | 46 | 45 | P2 | P9 | P8 | P1 | WWW.CIRCUITCO.COM
Document: EXTENDED PROTO CAPE REV A1 / ASSEMBLY DRAWING - TOP VIEW
DrillLegend: -ALL DIMENSIONS IN INCHES UNESS | OTHERWISE NOTED | - NO. LAYERS: 2 | - ARRAY: NO | - BOARD SIZE: 3.950000 x 2.825000 In. | - X-OUTS ALLOWED: YES | - SCORING: YES | - JUMP SCORING: NO | - TAB ROUT: NO | - MATERIAL: FR4 | - FINAL THICKNESS: 0.062000 | - PLATING: IMMERSION GOLD | - OUTER CU WEIGHT: 1.000000 | - MASK SIDES: BOTH | - MASK COLOR: WHITE | - SILKSCREEN SIDES: FRONT | - SILKSCREEN COLOR: BLACK | - GOLD FINGERS: NO | - MIN TRACE/SPACE: 8 | - MIN HOLE SIZE: 15 | - NO. HOLES UNDER 12 MIL: 0 | - PLATED SLOTS: NO | - PLATED EDGES: NO | - RoHS COMPLIANT: YES | - ITAR COMPLIANT: NO | - CONFORM TO IPC-A-600, CLASS 2: YES | - CLASS 3: NO | - MILSPEC: NO | - ADD UL LOGO: YES | - ADD DATE CODE: YES | - ADD 94V-0 MARKINGS: YES | - COUNTERSINKS/BORES: NO | - CONTROLLED DIELECTRIC: NO | - CARBON INK: NO | - BLIND/BURRIED VIAS: NO | - VIA IN PAD: NO | - MASK PLUGGED VIAS: NO | - CONDUCTIVE FILLED VIAS: NO | - CONTROLLED IMPEDANCE: NO | LAYER-STACK
DrillLegend_01-16: 01-16